# EAGLE design vga-sync-separator2-3.3V (EAGLE 9.6.2)
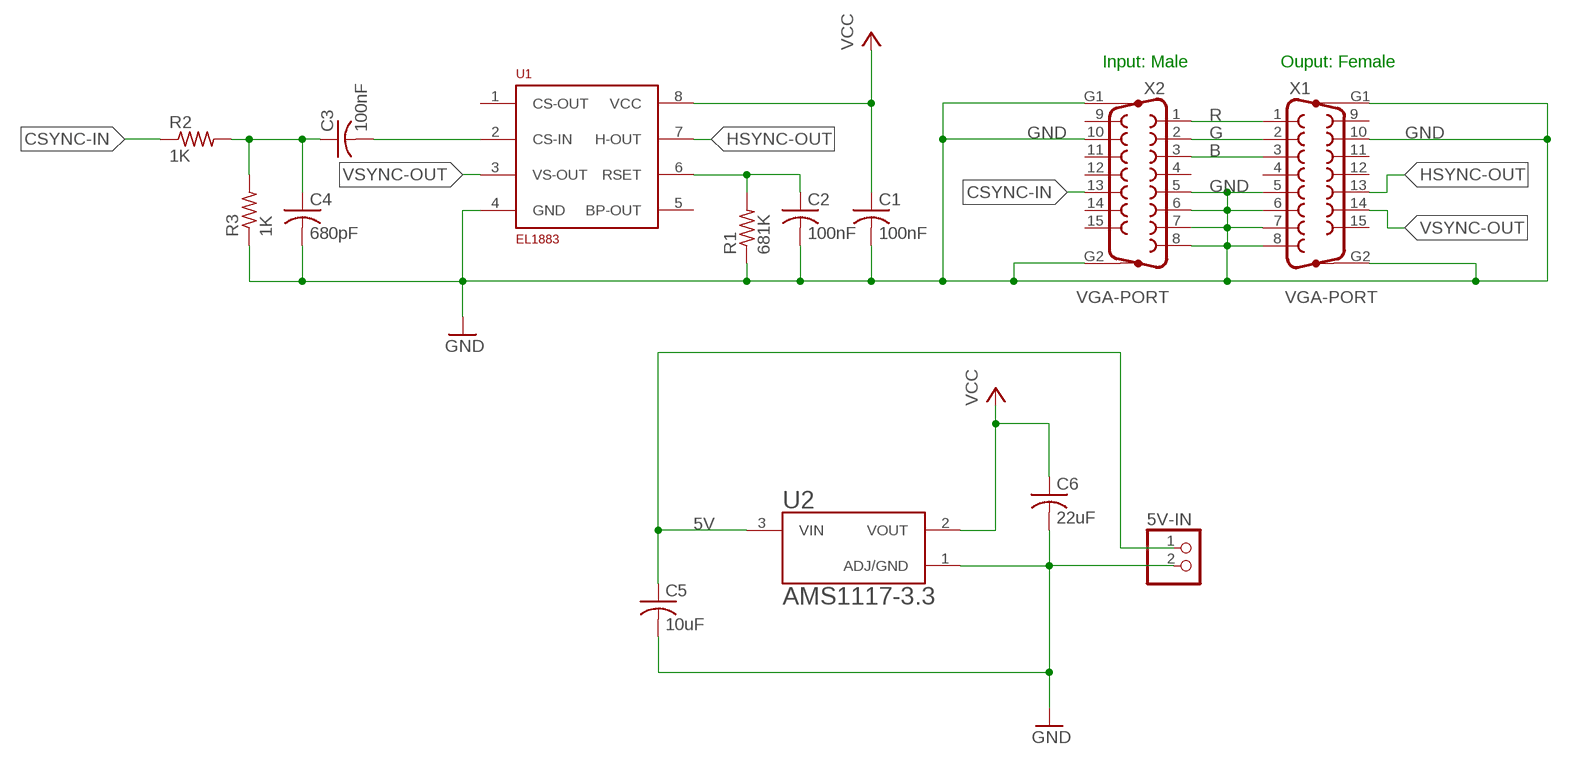
[diagram p0: schematic, sheet 1]

## Parts
5V-IN  PINHD-1X2  [1X02]
C1  100nF  C-USC0805  [C0805]
C2  100nF  C-USC0805  [C0805]
C3  100nF  C-USC0805  [C0805]
C4  680pF  C-USC0805  [C0805]
C5  10uF  C-USC0805  [C0805]
C6  22uF  C-USC0805  [C0805]
R1  681K  R-US_R0805  [R0805]
R2  1K  R-US_R0805  [R0805]
R3  1K  R-US_R0805  [R0805]
U1  EL1883  [SO-8]
U2  AMS1117-3.3  [SOT229P700X180-4N]
X1  VGA-PORT  [HD15H]
X2  VGA-PORT  [HD15H]

## Nets
5V: 5V-IN.1 C5.1 U2.3(VIN)
B: X1.3 X2.3
CSYNC-IN: R2.1 X2.13
G: X1.2 X2.2
GND: 5V-IN.2 C1.2 C2.2 C4.2 C5.2 C6.2 R1.1 R3.1 U1.4(GND) U2.1(ADJ/GND) X1.5 X1.6 X1.7 X1.8 X1.10 X1.G1 X1.G2 X2.5 X2.6 X2.7 X2.8 X2.10 X2.G1 X2.G2
HSYNC-OUT: U1.7(H-OUT) X1.13
N$1: C3.2 U1.2(CS-IN)
N$2: C3.1 C4.1 R2.2 R3.2
N$4: C2.1 R1.2 U1.6(RSET)
R: X1.1 X2.1
VCC: C1.1 C6.1 U1.8(VCC) U2.2(VOUT)
VSYNC-OUT: U1.3(VS-OUT) X1.14
Unconnected: U1.1(CS-OUT) U1.5(BP-OUT) X1.4 X1.9 X1.11 X1.12 X1.15 X2.4 X2.9 X2.11 X2.12 X2.14 X2.15

## Notes on the sheet
- Input: Male | Ouput: Female

## Library data of the parts
5V-IN = pinhead:PINHD-1X2: PIN HEADER
C1-C6 = rcl:C-US: CAPACITOR, American symbol; SPICEPREFIX: C
R1-R3 = rcl:R-US_: RESISTOR, American symbol; SPICEPREFIX: R
U1 = EL1883:EL1883
U2 = AMS1117-3.3:AMS1117-3.3: Sot223/Pkg 1-Amp 3.3-Volt Low Drop Out Voltage Regulatator Check availability <https://pricing.snapeda.com/parts/AMS1117-3.3/Advanced%20Monolithic%20Systems/view-part?ref=eda>; AVAILABILITY: Not in stock; DESCRIPTION: LDO Voltage Regulators 800MA LDO LINEAR REG; MF: Advanced Monolithic Systems; MP: AMS1117-3.3; PACKAGE: SOT-223 Seeed Technology; PRICE: None
X1 X2 = vga_port:VGA-PORT

## Board
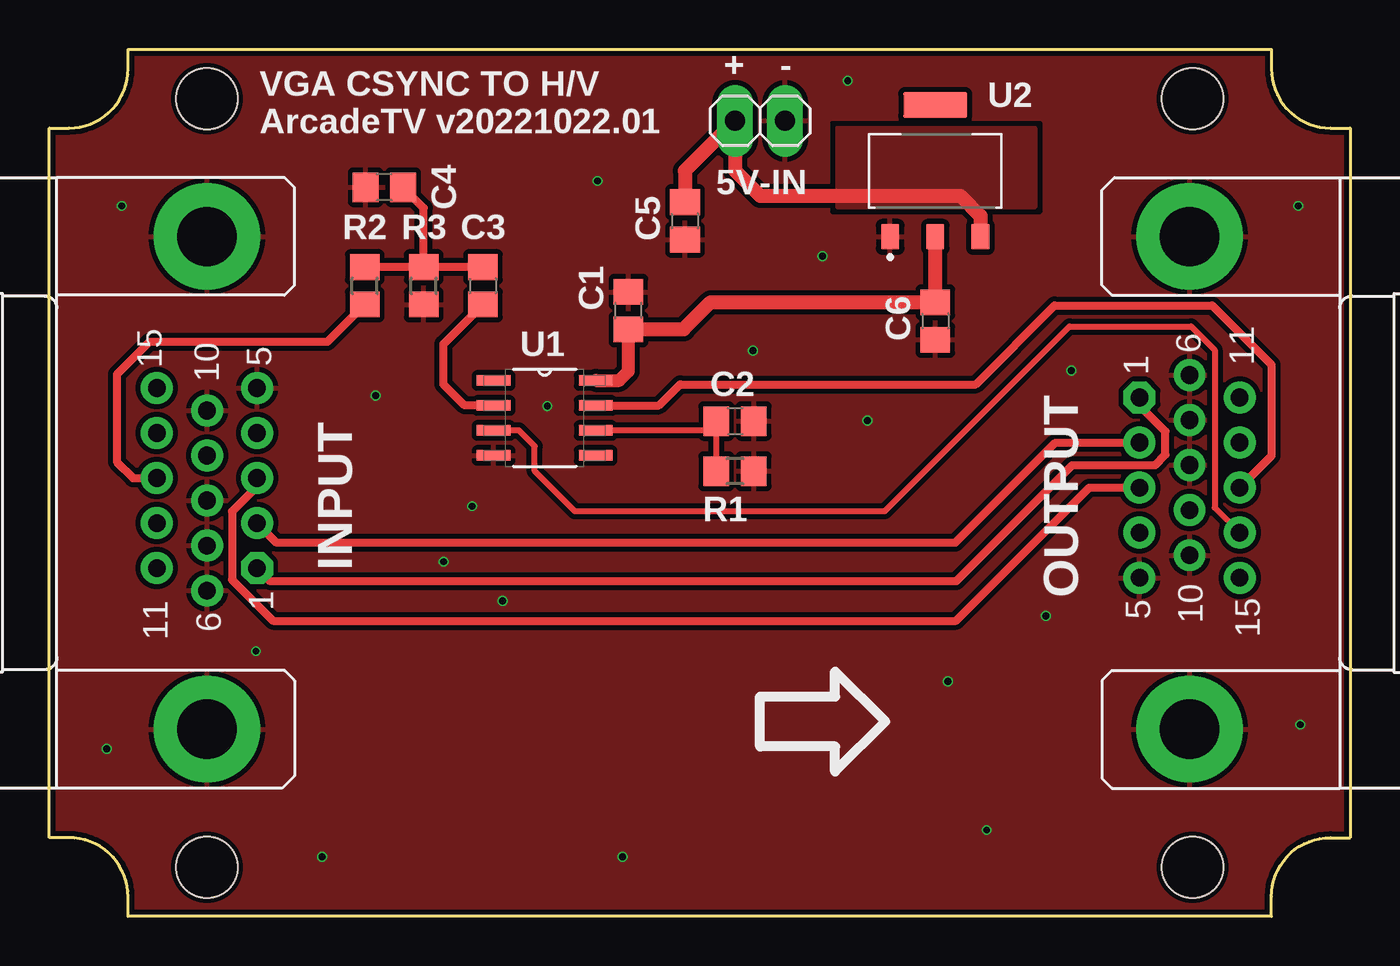
[diagram p1: board, top side]
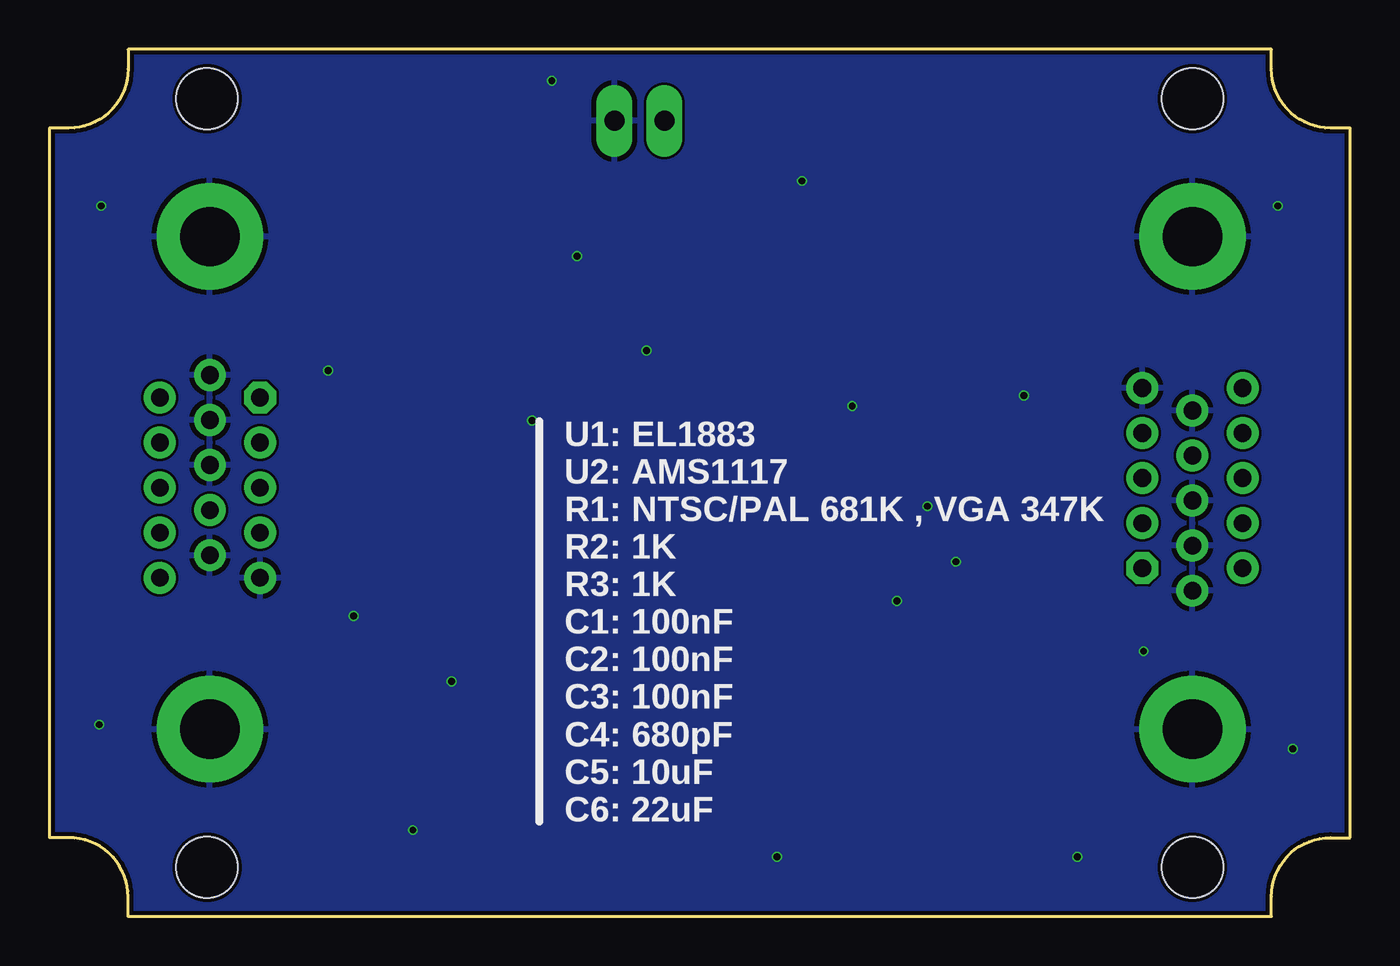
[diagram p2: board, bottom side, seen from below]

Size 66 x 44 mm. Coordinates in mm from the lower left corner, seen from the top.
Outline: 62,0 4,0 4,1 arc90 1,4 0,4 0,40 1,40 arc90 4,43 4,44 62,44 62,43 arc90 65,40 66,40 66,4 65,4 arc90 62,1 62,0
Copper layers (1*16): Top 0.035mm / dielectric 1.6mm / Bottom 0.035mm
Design rules "jlcpcb-2layers": minimum track width 5mil, minimum drill 0.3mm, track to track 5mil, track to pad 5mil, pad to pad 5mil, via to via 5mil, smd to smd 5mil, copper to edge 0.2mm, drill to drill 6mil, minimum pad ring 10mil, minimum via ring 3mil, stop-mask expansion 4mil, vias tented up to drill 0mil, thermal gap 10mil
Holes 3.1 mm at 8,41.5 8,2.5 58,2.5 58,41.5

### Footprints (pad centres in the part's own frame; a part is rotated, then mirrored left to right if it is on the bottom)
1X02 = drill 1.016 long: 1 -1.27,0; 2 1.27,0
C0805 = smd 1.3 x 1.5: 1 -0.95,0; 2 0.95,0
R0805 = smd 1.3 x 1.5: 1 -0.95,0; 2 0.95,0
SO-8 = smd 1.702 x 0.533: 1 -2.591,3.81; 2 -2.591,2.54; 3 -2.591,1.27; 4 -2.591,0; 5 2.591,0; 6 2.591,1.27; 7 2.591,2.54; 8 2.591,3.81
SOT229P700X180-4N = smd 0.93 x 1.31: 1 -2.29,-3.345; 2 0,-3.345; 3 2.29,-3.345 | smd 3.24 x 1.31: 4 0,3.345
HD15H = drill 0.9 octagon: 1 4.329,2.54 | drill 0.9: 2 2.043,2.54; 3 -0.243,2.54; 4 -2.529,2.54; 5 -4.815,2.54; 6 5.472,0; 7 3.186,0; 8 0.9,0; 9 -1.386,0; 10 -3.672,0; 11 4.329,-2.54; 12 2.043,-2.54; 13 -0.243,-2.54; 14 -2.529,-2.54; 15 -4.815,-2.54 | drill 3: G1 -12.5,0; G2 12.5,0

### Placement (x,y rotation side)
5V-IN  36.06,40.37 0 top
C1  29.38,30.74 90 top
C2  34.79,25.13 0 top
C3  22,32 270 top
C4  17,37 180 top
C5  32.25,35.29 270 top
C6  44.95,30.21 270 top
R1  34.79,22.59 180 top
R2  16,32 90 top
R3  19,32 90 top
U1  25.13,23.39 0 top
U2  44.95,37.83 0 top
X1  57.85,22 90 top
X2  8,22 270 top

### Tracks (layer width: path | path; a pad name or v marks a point on that pad's centre or on a via)
5V
  Top 0.711: U2.3 47.24,35.54 46.22,36.56 36.06,36.56 34.79,37.83 5V-IN.1 32.25,37.83 C5.1
  pour Top: 40,40 50,40 50,36 40,36
B
  Top 0.406: X2.3 10.54,21.82 9.28,20.55 9.28,17.08 11.35,15 46,15 52.76,21.76 X1.3
CSYNC-IN
  Top 0.406: R2.1 14.11,29.16 5.08,29.16 3.42,27.5 3.42,23.07 4.25,22.24 X2.13
G
  Top 0.406: X2.2 11.54,18.96 45.96,18.96 51.04,24.04 X1.2
GND  (via drill 0.35)
  other vias: 63.47,9.73 16.57,26.43 2.92,8.51 21.45,20.81 20,18 29.08,3.03 47.55,4.38 27.8,37.32 3.67,36.05 45.59,11.92 50.55,15.24 63.36,36.05 41.51,25.16 51.85,27.7 39.23,33.51 40.51,42.4 35.7,28.7 25.27,25.89 13.84,3.03 23,16 10.48,13.46
  pour Top (isolate 0.254, rank 2): -0.5,0 -0.5,45 66.5,45 66.5,0
  pour Bottom: -0.77,-0.27 66.54,-0.27 66.54,45.45 -0.77,45.45
HSYNC-OUT
  Top 0.406: U1.7 30.93,25.93 32,27 47,27 51,31 59,31 62,28 62,23.37 X1.13
N$1
  Top 0.406: U1.2 21.07,25.93 20,27 20,29.05 C3.2
N$2
  Top 0.406: C3.1 R3.2 | R3.2 R2.2 | R3.2 19,35.95 C4.1
N$4
  Top 0.305: R1.2 C2.1 33.37,24.66 U1.6
R
  Top 0.406: X2.1 11.21,17 46,17 51.9,22.9 56.1,22.9 56.63,23.43 56.63,24.6 55.31,25.92 X1.1
VCC
  Top 0.66: U1.8 28.91,27.2 29.38,27.67 C1.1
  Top 0.711: U2.2 C6.1 33.55,31.16 32.18,29.79 C1.1
VSYNC-OUT
  Top 0.305: U1.3 23.83,24.66 24.63,23.86 24.63,22.59 26.67,20.55 42.37,20.55 51.76,29.94 57.94,29.94 59.13,28.75 59.13,20.73 X1.14

### Text on the board
tPlace: VGA CSYNC TO H/V / ArcadeTV v20221022.01 | + | - | INPUT | OUTPUT
bPlace: U1: EL1883 / U2: AMS1117 / R1: NTSC/PAL 681K , VGA 347K / R2: 1K / R3: 1K / C1: 100nF / C2: 100nF / C3: 100nF / C4: 680pF / C5: 10uF / C6: 22uF